# EAGLE design LMH6881-Breakout (EAGLE 7.7.0)
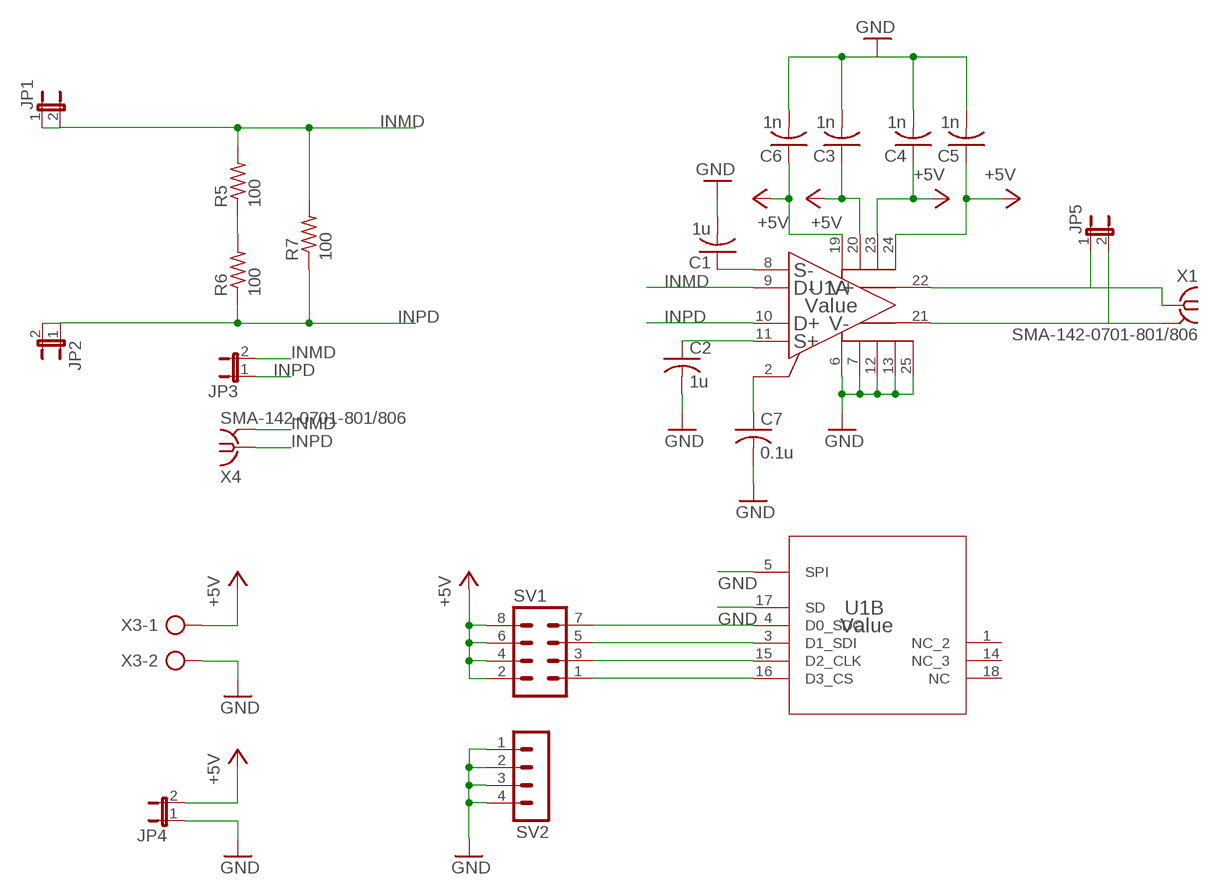
[diagram p0: schematic, sheet 1]

## Parts
C1  1u  C-USC0805  [C0805]
C2  1u  C-USC0805  [C0805]
C3  1n  C-USC0805  [C0805]
C4  1n  C-USC0805  [C0805]
C5  1n  C-USC0805  [C0805]
C6  1n  C-USC0805  [C0805]
C7  0.1u  C-USC0805  [C0805]
JP1  JP1E  [JP1]
JP2  JP1E  [JP1]
JP3  JP1E  [JP1]
JP4  JP1E  [JP1]
JP5  JP1E  [JP1]
R5  100  R-US_R0805  [R0805]
R6  100  R-US_R0805  [R0805]
R7  100  R-US_R0805  [R0805]
SV1  MA04-2  [MA04-2]
SV2  MA04-1  [MA04-1]
U1  Value  LMH6881SQX/NOPB  [RTW0024A]
X1  SMA-142-0701-801/806  [J502-ND-142-0701-801/806]
X3  AK500/2  [AK500/2]
X4  SMA-142-0701-801/806  [J502-ND-142-0701-801/806]

## Nets
+5V: C3.1 C4.1 C5.1 C6.1 JP4.2 SV1.2 SV1.4 SV1.6 SV1.8 U1.19(A:VCC_2) U1.20(A:VCC_3) U1.23(A:VCC_4) U1.24(A:VCC) X3.1
GND: C1.2 C2.2 C3.2 C4.2 C5.2 C6.2 C7.2 JP4.1 SV2.1 SV2.2 SV2.3 SV2.4 U1.5(B:SPI) U1.6(A:GND_2) U1.7(A:GND_3) U1.12(A:GND_4) U1.13(A:GND) U1.17(B:SD) U1.25(A:PAD) X3.2
INMD: JP1.1 JP1.2 JP3.2 R5.2 R7.2 U1.9(A:INMD) X4.G@1 X4.G@2 X4.G@3 X4.G@4
INPD: JP2.1 JP2.2 JP3.1 R6.1 R7.1 U1.10(A:INPD) X4.1
N$1: C7.1 U1.2(A:OCM)
N$3: C1.1 U1.8(A:INMS)
N$4: C2.1 U1.11(A:INPS)
N$5: JP5.1 U1.22(A:OUTP) X1.1
N$6: JP5.2 U1.21(A:OUTM) X1.G@1 X1.G@2 X1.G@3 X1.G@4
N$7: R5.1 R6.2
N$11: SV1.7 U1.4(B:D0_SDO)
N$15: SV1.5 U1.3(B:D1_SDI)
N$16: SV1.3 U1.15(B:D2_CLK)
N$17: SV1.1 U1.16(B:D3_CS)
Unconnected: U1.1(B:NC_2) U1.14(B:NC_3) U1.18(B:NC)

## Library data of the parts
C1-C7 = resistor:C-US: CAPACITOR, American symbol
JP1-JP5 = jumper:JP1E: JUMPER
R5-R7 = resistor:R-US_: RESISTOR, American symbol
SV1 = con-lstb:MA04-2: PIN HEADER; OC_FARNELL: unknown; OC_NEWARK: unknown
SV2 = con-lstb:MA04-1: PIN HEADER; OC_FARNELL: unknown; OC_NEWARK: unknown
U1 = LMH6881:LMH6881SQX/NOPB; ALTERNATEPARTNUMBER: LMH6881SQNOPB; APPLICATION_BUILDNUMBER: *; COMPTYPE: IC; MANUFACTURER: Texas Instruments; MOUNTTYPE: SMT; PACKAGEREFERENCE: RTW0024A; PARTNUMBER: LMH6881SQXNOPB; PIN_COUNT: 25; REFDES: RefDes; ROHS: Y; TYPE: TYPE
X1 X4 = con-coax:SMA-: SMA 50 Ohm End Launch Jack Receptacle - Round Contact Johnson Components Source: www.johnsoncomponents.com .. J502-ND.pdf; MF: JOHNSON COMPONENTS; MPN: 142-0701-801; OC_FARNELL: 1608592; OC_NEWARK: 90F2624
X3 = con-ptr500:AK500/2: CONNECTOR; OC_FARNELL: unknown; OC_NEWARK: unknown

## Board
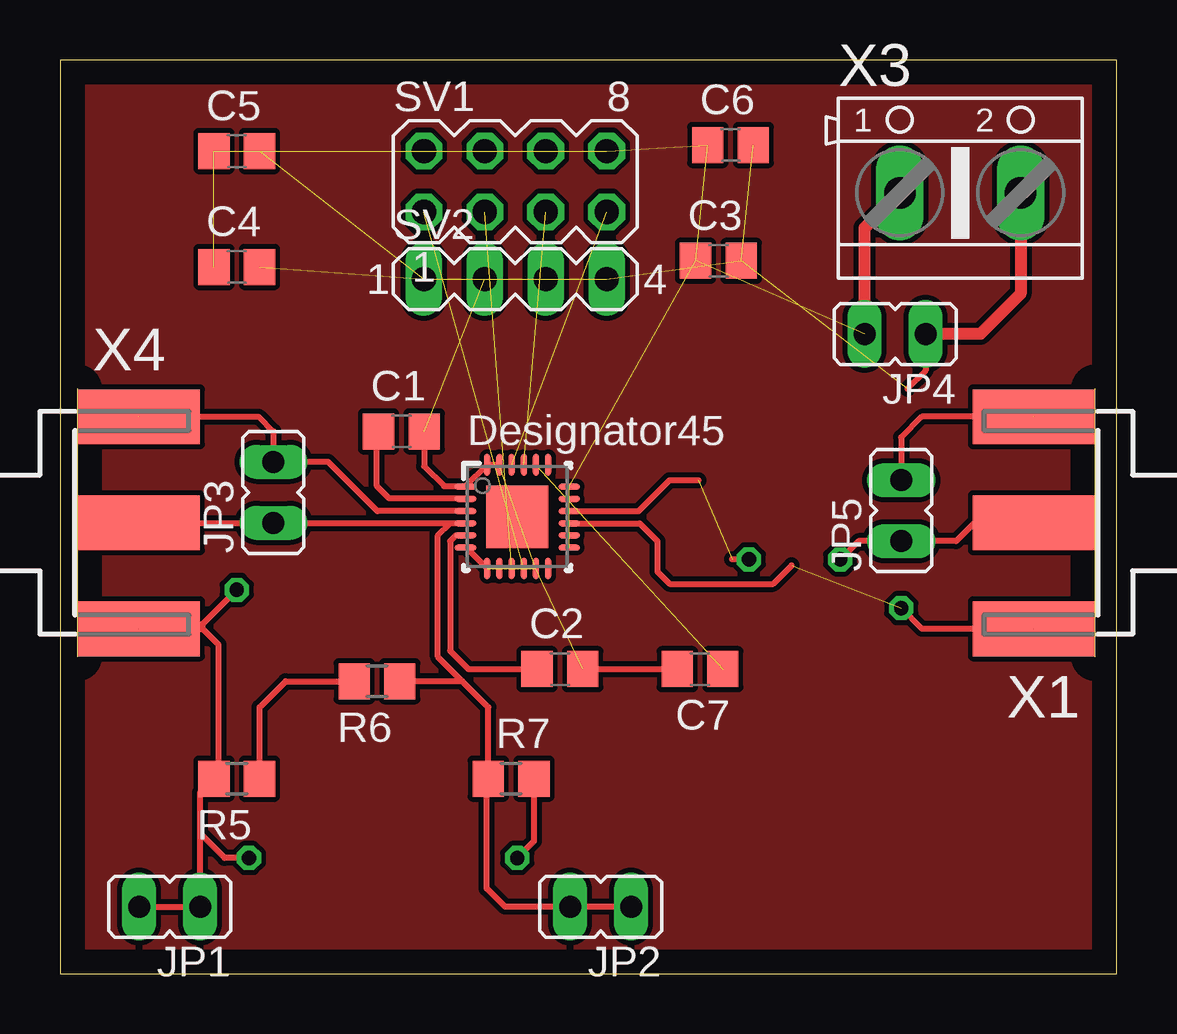
[diagram p1: board, top side]
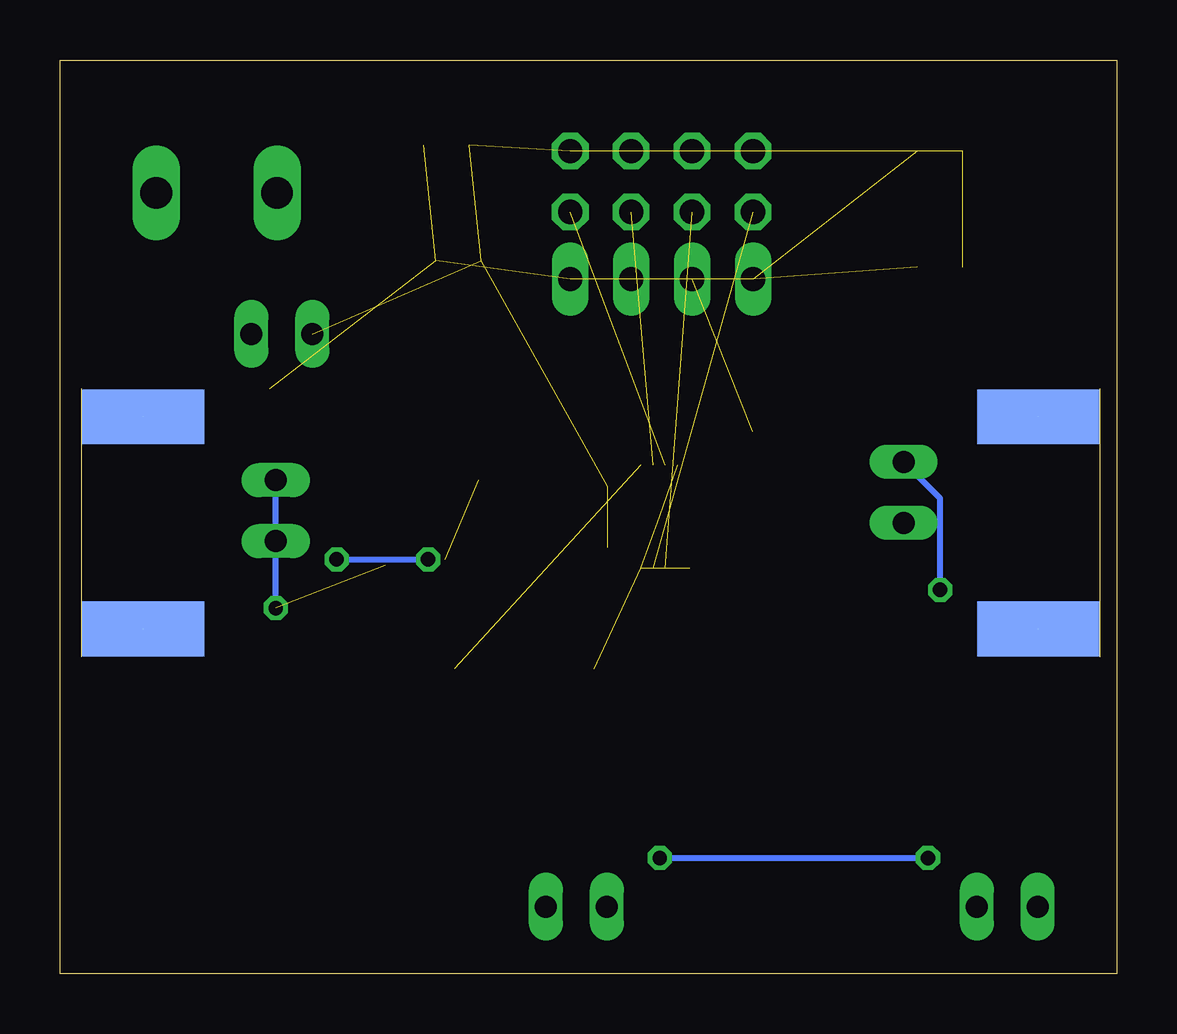
[diagram p2: board, bottom side, seen from below]

Size 44.04 x 38.09 mm. Coordinates in mm from the lower left corner, seen from the top.
Outline: 0,0 44.04,0 44.04,38.09 0,38.09 0,0
Copper layers (1*16): Top 0.035mm / dielectric 1.5mm / Bottom 0.035mm
Design rules "default": minimum track width 10mil, minimum drill 24mil, track to track 8mil, track to pad 8mil, pad to pad 8mil, via to via 8mil, smd to smd 8mil, copper to edge 40mil, drill to drill 8mil, minimum pad ring 10mil, minimum via ring 8mil, stop-mask expansion 4mil, vias tented up to drill 0mil, thermal gap 10mil

### Footprints (pad centres in the part's own frame; a part is rotated, then mirrored left to right if it is on the bottom)
C0805 = smd 1.3 x 1.5: 1 -0.95,0; 2 0.95,0
JP1 = drill 0.914 long: 1 0,-1.27; 2 0,1.27
R0805 = smd 1.3 x 1.5: 1 -0.95,0; 2 0.95,0
MA04-2 = drill 1.016 octagon: 1 -3.81,-1.27; 2 -3.81,1.27; 3 -1.27,-1.27; 4 -1.27,1.27; 5 1.27,-1.27; 6 1.27,1.27; 7 3.81,-1.27; 8 3.81,1.27
MA04-1 = drill 1.016 long: 1 -3.81,0; 2 -1.27,0; 3 1.27,0; 4 3.81,0
RTW0024A = smd 0.24 x 0.889: 1 1.29,2.164; 2 0.782,2.164; 3 0.274,2.164; 4 -0.234,2.164; 5 -0.742,2.164; 6 -1.25,2.164; 13 -1.25,-2.154; 14 -0.742,-2.154; 15 -0.234,-2.154; 16 0.274,-2.154; 17 0.782,-2.154; 18 1.29,-2.154 | smd 0.889 x 0.24: 7 -2.154,1.25; 8 -2.154,0.742; 9 -2.154,0.234; 10 -2.154,-0.274; 11 -2.154,-0.782; 12 -2.154,-1.29; 19 2.164,-1.29; 20 2.164,-0.782; 21 2.164,-0.274; 22 2.164,0.234; 23 2.164,0.742; 24 2.164,1.25 | smd 2.6 x 2.6: 25 0,0 | smd 0.5 x 0.5: V 0,1
J502-ND-142-0701-801/806 = smd 5.08 x 2.286: 1 2.565,0; G@1 2.565,4.42; G@2 2.565,-4.42 | smd 5.08 x 2.286 bottom: G@3 2.565,4.42; G@4 2.565,-4.42
AK500/2 = drill 1.321 long: 1 -2.515,0; 2 2.515,0

### Placement (x,y rotation side)
C1  14.22,22.61 0 top
C2  20.83,12.7 0 top
C3  27.43,29.72 0 top
C4  7.37,29.46 0 top
C5  7.37,34.29 0 top
C6  27.94,34.54 0 top
C7  26.67,12.7 180 top
JP1  4.57,2.79 90 top
JP2  22.53,2.79 90 top
JP3  8.89,20.07 0 top
JP4  34.8,26.67 90 top
JP5  35.05,19.3 0 top
R5  7.37,8.13 180 top
R6  13.21,12.19 180 top
R7  18.8,8.13 0 top
SV1  18.97,33.02 0 top
SV2  18.97,28.96 0 top
U1  19.05,19.05 0 top
X1  43.14,18.8 180 top
X3  37.51,32.55 0 top
X4  0.72,18.8 0 top

### Tracks (layer width: path | path; a pad name or v marks a point on that pad's centre or on a via)
+5V  (12 unrouted)
  Top 0.254: JP4.2 33.53,25.91
  Top 0.508: JP4.2 33.53,31.08 X3.1
GND  (13 unrouted)
  Top 0.254: C1.2 15.17,21.15 16,20.32 16.88,20.32 | 16.88,20.32 U1.7 | U1.6 | C2.2 C7.2 | U1.12 16.94,17.76 U1.13 | 16.88,20.32 16.91,20.32 U1.6 | U1.5 U1.6 | JP4.1 36.07,25.15 35.31,24.38
  Top 0.508: X3.2 40.03,28.34 38.35,26.67 JP4.1
INMD  (via drill 0.6)  (2 unrouted)
  Top 0.254: X4.G@3 8.28,23.22 8.89,22.61 JP3.2 11.18,21.34 13.23,19.28 U1.9 | JP1.2 JP1.1 5.84,5.84 | X4.G@2 5.94,14.38 | 5.94,14.38 6.6,13.72 6.6,8.32 R5.2 5.84,7.55 5.84,5.84 | 5.94,14.38 5.94,14.58 v7.37,16 | R7.2 19.75,5.52 v19.05,4.83 | v7.87,4.83 6.86,4.83 5.84,5.84
  Bottom 0.254: v7.37,16 7.37,19.81 JP3.2 | v19.05,4.83 v7.87,4.83
INPD
  Top 0.254: X4.1 JP3.1 8.91,18.78 16.26,18.78 | U1.10 16.26,18.78 | JP2.1 JP2.2 18.54,2.79 17.78,3.56 17.78,8.06 R7.1 17.85,11.11 16.76,12.19 | 16.76,12.19 R6.1 | 16.76,12.19 15.75,13.21 15.75,18.27 16.26,18.78
N$1  (1 unrouted)
N$2
  pour Top: 0,0 0,38.1 43.94,38.1 43.94,0
N$3
  Top 0.254: U1.8 16.88,19.81 13.72,19.81 13.21,20.32 13.21,22.54 C1.1
N$4
  Top 0.254: U1.11 16.49,18.27 16.26,18.03 16.26,13.46 17.02,12.7 C2.1
N$5  (via drill 0.6)  (1 unrouted)
  Top 0.254: U1.22 24.11,19.28 25.4,20.57 26.6,20.57 | X1.1 38.1,18.8 37.34,18.03 JP5.1 33.27,18.03 v32.51,17.27 | v28.7,17.27 28.01,17.27
  Bottom 0.254: v32.51,17.27 v28.7,17.27
N$6  (via drill 0.6)  (3 unrouted)
  Top 0.254: U1.21 24.15,18.78 24.89,18.03 24.89,16.76 25.4,16.26 29.72,16.26 30.48,17.02 | 34.99,20.51 JP5.2 35.05,22.35 35.92,23.22 X1.G@2 | X1.G@3 35.92,14.38 v35.05,15.24
  Bottom 0.254: v35.05,15.24 JP5.2
N$7
  Top 0.254: R5.1 8.32,11.11 9.4,12.19 R6.2
N$11  (1 unrouted)
N$15  (1 unrouted)
N$16  (1 unrouted)
N$17  (1 unrouted)